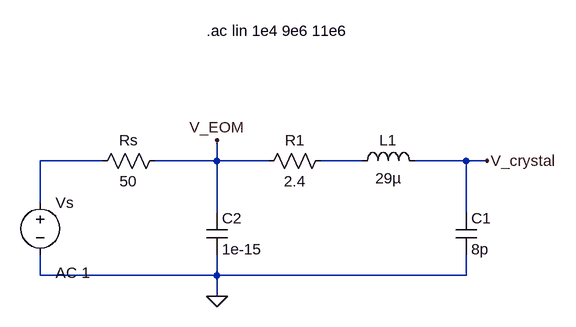
[diagram p0: schematic resonant_EOM.asc]
resonant_EOM.asc, the LTspice schematic file:
Version 4
SHEET 1 880 680
WIRE -128 112 -224 112
WIRE 48 112 48 80
WIRE 48 112 -48 112
WIRE 128 112 48 112
WIRE 272 112 208 112
WIRE 432 112 352 112
WIRE 464 112 432 112
WIRE -224 176 -224 112
WIRE 48 192 48 112
WIRE 432 192 432 112
WIRE -224 288 -224 256
WIRE 48 288 48 256
WIRE 48 288 -224 288
WIRE 432 288 432 256
WIRE 432 288 48 288
WIRE 48 320 48 288
FLAG 48 320 0
FLAG 464 112 V_crystal
FLAG 48 80 V_EOM
SYMBOL res 224 96 R90
WINDOW 0 0 56 VBottom 2
WINDOW 3 32 56 VTop 2
SYMATTR InstName R1
SYMATTR Value 2.4
SYMBOL ind 256 128 R270
WINDOW 0 32 56 VTop 2
WINDOW 3 5 56 VBottom 2
SYMATTR InstName L1
SYMATTR Value 29µ
SYMBOL cap 416 192 R0
SYMATTR InstName C1
SYMATTR Value 8p
SYMBOL cap 32 192 R0
SYMATTR InstName C2
SYMATTR Value 1e-15
SYMBOL voltage -224 160 R0
WINDOW 123 24 124 Left 2
WINDOW 39 0 0 Left 0
SYMATTR Value2 AC 1
SYMATTR InstName Vs
SYMATTR Value ""
SYMBOL res -32 96 R90
WINDOW 0 0 56 VBottom 2
WINDOW 3 32 56 VTop 2
SYMATTR InstName Rs
SYMATTR Value 50
TEXT 32 -88 Left 2 !.ac lin 1e4 9e6 11e6

The netlist it stands for:
* resonant_EOM.asc
R1 N002 V_EOM 2.4
L1 N002 V_crystal 29µ
C1 V_crystal 0 8p
C2 V_EOM 0 1e-15
Vs N001 0 AC 1
Rs V_EOM N001 50
.ac lin 1e4 9e6 11e6
.backanno
.end